# EAGLE design smokey powell board V1.4 (EAGLE 9.3.0)
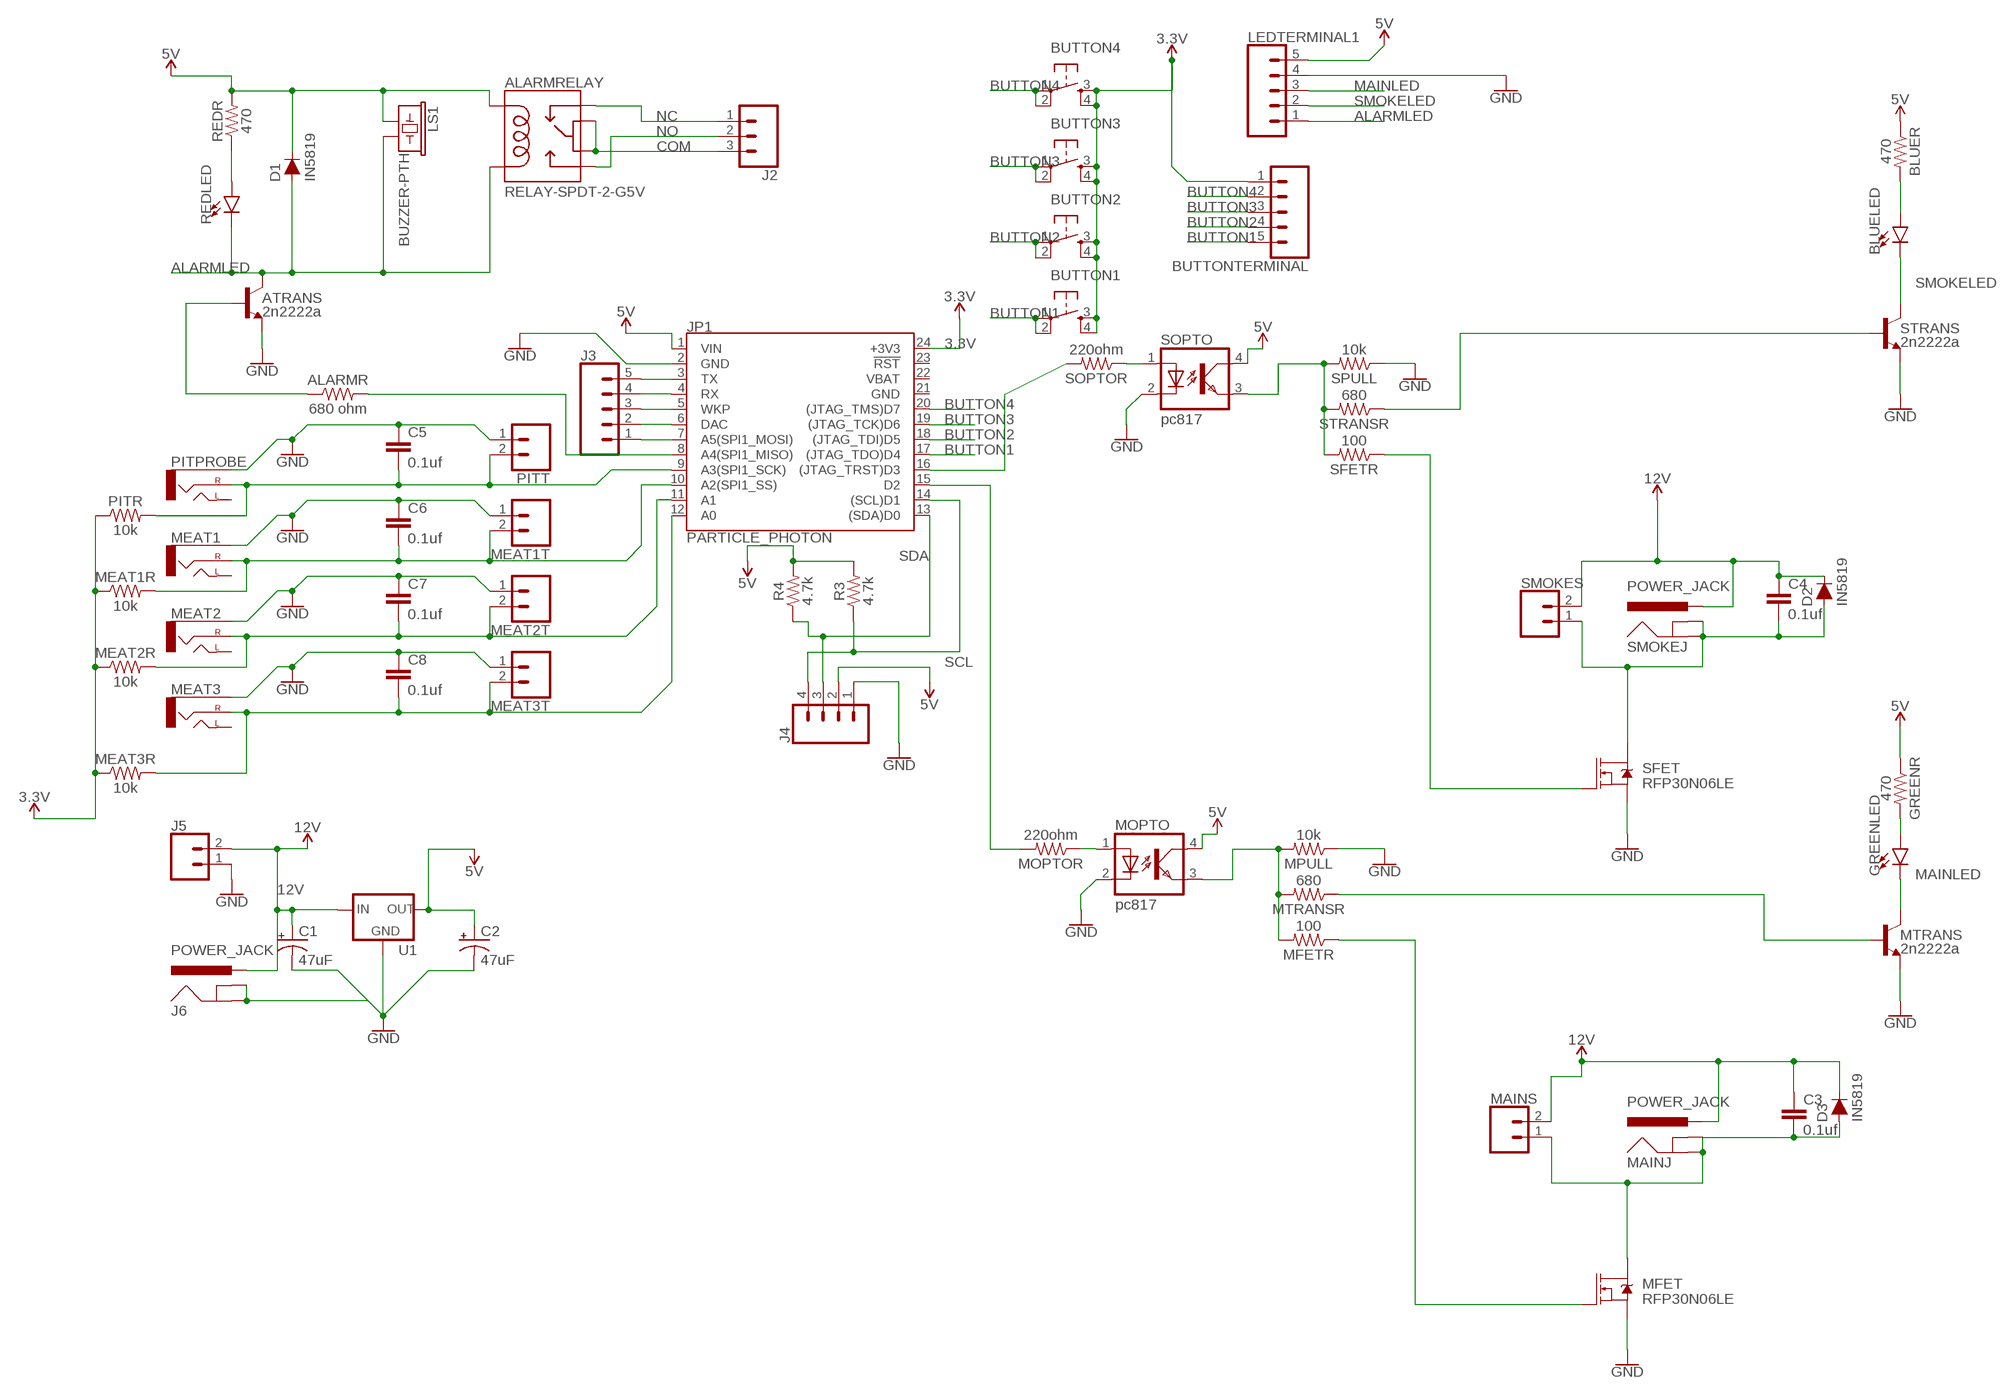
[diagram p0: schematic, sheet 1]

## Parts
ALARMR  680 ohm  RESISTORAXIAL-0.3  [AXIAL-0.3]
ALARMRELAY  RELAY-SPDT-2-G5V  [RELAY-G5V]
ATRANS  2n2222a  TRANS_NPN-P2N2222A  [TO-92]
BLUELED  LED5MM  [LED_5MM]
BLUER  470  RESISTORAXIAL-0.3  [AXIAL-0.3]
BUTTON1  TAC_SWITCHPTH  [TACTILE-PTH]
BUTTON2  TAC_SWITCHPTH  [TACTILE-PTH]
BUTTON3  TAC_SWITCHPTH  [TACTILE-PTH]
BUTTON4  TAC_SWITCHPTH  [TACTILE-PTH]
BUTTONTERMINAL  CONN_05PTH_LONGPADS  [1X05_LONGPADS]
C1  47uF  100UF-POLAR-RADIAL-2.5MM-25V-20%  [CPOL-RADIAL-2.5MM-6.5MM]
C2  47uF  100UF-POLAR-RADIAL-2.5MM-25V-20%  [CPOL-RADIAL-2.5MM-6.5MM]
C3  0.1uf  C2.5/2  [C2.5-2]
C4  0.1uf  C2.5/2  [C2.5-2]
C5  0.1uf  C2.5/2  [C2.5-2]
C6  0.1uf  C2.5/2  [C2.5-2]
C7  0.1uf  C2.5/2  [C2.5-2]
C8  0.1uf  C2.5/2  [C2.5-2]
D1  IN5819  DIODE-PTH  [DIODE-1N4001]
D2  IN5819  DIODE-PTH  [DIODE-1N4001]
D3  IN5819  DIODE-PTH  [DIODE-1N4001]
GREENLED  LED5MM  [LED_5MM]
GREENR  470  RESISTORAXIAL-0.3  [AXIAL-0.3]
J2  CONN_03-SCREW-5MM  [SCREWTERMINAL-5MM-3]
J3  CONN_05  [1X05]
J4  CONN_04LONGPADS  [1X04_LONGPADS]
J5  CONN_025MM  [SCREWTERMINAL-5MM-2]
J6  POWER_JACK  [POWER_JACK_PTH]
JP1  PARTICLE_PHOTON  [PARTICLE_PHOTON]
LEDTERMINAL1  CONN_05PTH_LONGPADS  [1X05_LONGPADS]
LS1  BUZZER-PTH  [BUZZER-12MM]
MAINJ  POWER_JACK  [POWER_JACK_PTH]
MAINS  CONN_025MM  [SCREWTERMINAL-5MM-2]
MEAT1  AUDIO_JACK_2.5MM_2.5MM  [STEREOJACK2.5MM_STEREOJACK2.5MM]
MEAT1R  10k  1MOHM-HORIZ-1/4W-5%  [AXIAL-0.3]
MEAT1T  CONN_02PTH3  [1X02_LONGPADS]
MEAT2  AUDIO_JACK_2.5MM_2.5MM  [STEREOJACK2.5MM_STEREOJACK2.5MM]
MEAT2R  10k  1MOHM-HORIZ-1/4W-5%  [AXIAL-0.3]
MEAT2T  CONN_02PTH3  [1X02_LONGPADS]
MEAT3  AUDIO_JACK_2.5MM_2.5MM  [STEREOJACK2.5MM_STEREOJACK2.5MM]
MEAT3R  10k  1MOHM-HORIZ-1/4W-5%  [AXIAL-0.3]
MEAT3T  CONN_02PTH3  [1X02_LONGPADS]
MFET  RFP30N06LE  MOSFET-NCH-FQP30N06L  [TO220V]
MFETR  100  RESISTORAXIAL-0.3  [AXIAL-0.3]
MOPTO  pc817  SFH618A-2  [DIP4]
MOPTOR  220ohm  RESISTORAXIAL-0.3  [AXIAL-0.3]
MPULL  10k  RESISTORAXIAL-0.3  [AXIAL-0.3]
MTRANS  2n2222a  TRANS_NPN-P2N2222A  [TO-92]
MTRANSR  680  RESISTORAXIAL-0.3  [AXIAL-0.3]
PITPROBE  AUDIO_JACK_2.5MM_2.5MM  [STEREOJACK2.5MM_STEREOJACK2.5MM]
PITR  10k  1MOHM-HORIZ-1/4W-5%  [AXIAL-0.3]
PITT  CONN_02PTH3  [1X02_LONGPADS]
R3  4.7k  RESISTORAXIAL-0.3  [AXIAL-0.3]
R4  4.7k  RESISTORAXIAL-0.3  [AXIAL-0.3]
REDLED  LED5MM  [LED_5MM]
REDR  470  RESISTORAXIAL-0.3  [AXIAL-0.3]
SFET  RFP30N06LE  MOSFET-NCH-FQP30N06L  [TO220V]
SFETR  100  RESISTORAXIAL-0.3  [AXIAL-0.3]
SMOKEJ  POWER_JACK  [POWER_JACK_PTH]
SMOKES  CONN_025MM  [SCREWTERMINAL-5MM-2]
SOPTO  pc817  SFH618A-2  [DIP4]
SOPTOR  220ohm  RESISTORAXIAL-0.3  [AXIAL-0.3]
SPULL  10k  RESISTORAXIAL-0.3  [AXIAL-0.3]
STRANS  2n2222a  TRANS_NPN-P2N2222A  [TO-92]
STRANSR  680  RESISTORAXIAL-0.3  [AXIAL-0.3]
U1  V_REG_78XXSINK  [TO220-IGO]

## Nets
3.3V: BUTTON1.3 BUTTON1.4 BUTTON2.3 BUTTON2.4 BUTTON3.3 BUTTON3.4 BUTTON4.3 BUTTON4.4 BUTTONTERMINAL.1 JP1.24(+3V3) MEAT1R.P$1 MEAT2R.P$1 MEAT3R.P$1 PITR.P$1
5V: ALARMRELAY.2 BLUER.P$1 C2.1(+) D1.C GREENR.P$1 J4.2 JP1.1(VIN) LEDTERMINAL1.5 LS1.+ MOPTO.4(COL) R3.P$2 R4.P$2 REDR.P$2 SOPTO.4(COL) U1.OUT
12V: C1.1(+) C3.1 C4.1 D2.C D3.C J5.2 J6.PWR MAINJ.PWR MAINS.2 SMOKEJ.PWR SMOKES.2 U1.IN
ALARMLED: ALARMRELAY.9 ATRANS.1(C) D1.A LEDTERMINAL1.1 LS1.- REDLED.K(C)
BUTTON1: BUTTON1.1 BUTTON1.2 BUTTONTERMINAL.5 JP1.17((JTAG_TDO)D4)
BUTTON2: BUTTON2.1 BUTTON2.2 BUTTONTERMINAL.4 JP1.18((JTAG_TDI)D5)
BUTTON3: BUTTON3.1 BUTTON3.2 BUTTONTERMINAL.3 JP1.19((JTAG_TCK)D6)
BUTTON4: BUTTON4.1 BUTTON4.2 BUTTONTERMINAL.2 JP1.20((JTAG_TMS)D7)
COM: ALARMRELAY.5 ALARMRELAY.6 J2.3
GND: ATRANS.3(E) C1.2(-) C2.2(-) C5.1 C6.1 C7.1 C8.1 J4.1 J5.1 J6.GND J6.GNDBREAK JP1.2(GND) LEDTERMINAL1.4 MEAT1.RING1(SLEEVE) MEAT1T.1 MEAT2.RING1(SLEEVE) MEAT2T.1 MEAT3.RING1(SLEEVE) MEAT3T.1 MFET.3(S) MOPTO.2(C) MPULL.P$1 MTRANS.3(E) PITPROBE.RING1(SLEEVE) PITT.1 SFET.3(S) SOPTO.2(C) SPULL.P$1 STRANS.3(E) U1.GND
MAINLED: GREENLED.K(C) LEDTERMINAL1.3 MTRANS.1(C)
N$1: C7.2 JP1.11(A1) MEAT2.TIP(RIGHT) MEAT2R.P$2 MEAT2T.2
N$5: ALARMR.P$2 JP1.8(A4(SPI1_MISO))
N$6: MTRANS.2(B) MTRANSR.P$1
N$7: ALARMR.P$1 ATRANS.2(B)
N$8: STRANS.2(B) STRANSR.P$1
N$9: J3.5 JP1.3(TX)
N$10: J3.4 JP1.4(RX)
N$11: J3.3 JP1.5(WKP)
N$12: J3.2 JP1.6(DAC)
N$13: J3.1 JP1.7(A5(SPI1_MOSI))
N$14: MFET.1(G) MFETR.P$1
N$15: C3.2 D3.A MAINJ.GND MAINJ.GNDBREAK MAINS.1 MFET.2(D)
N$16: JP1.16((JTAG_TRST)D3) SOPTOR.P$2
N$17: JP1.15(D2) MOPTOR.P$2
N$18: SOPTO.1(A) SOPTOR.P$1
N$19: MOPTO.1(A) MOPTOR.P$1
N$20: MFETR.P$2 MOPTO.3(EMIT) MPULL.P$2 MTRANSR.P$2
N$21: SFETR.P$2 SOPTO.3(EMIT) SPULL.P$2 STRANSR.P$2
N$22: SFET.1(G) SFETR.P$1
N$23: REDLED.A REDR.P$1
N$24: C4.2 D2.A SFET.2(D) SMOKEJ.GND SMOKEJ.GNDBREAK SMOKES.1
N$25: BLUELED.A BLUER.P$2
N$27: GREENLED.A GREENR.P$2
N$28: C8.2 JP1.12(A0) MEAT3.TIP(RIGHT) MEAT3R.P$2 MEAT3T.2
N$29: C6.2 JP1.10(A2(SPI1_SS)) MEAT1.TIP(RIGHT) MEAT1R.P$2 MEAT1T.2
N$30: C5.2 JP1.9(A3(SPI1_SCK)) PITPROBE.TIP(RIGHT) PITR.P$2 PITT.2
NC: ALARMRELAY.1 J2.1
NO: ALARMRELAY.10 J2.2
SCL: J4.4 JP1.14((SCL)D1) R3.P$1
SDA: J4.3 JP1.13((SDA)D0) R4.P$1
SMOKELED: BLUELED.K(C) LEDTERMINAL1.2 STRANS.1(C)
Unconnected: JP1.23(!RST!) MEAT1.SHIELD(LEFT) MEAT2.SHIELD(LEFT) MEAT3.SHIELD(LEFT) PITPROBE.SHIELD(LEFT)

## Power pins joined to a net without a drawn wire
GND: JP1.21(GND)
VBAT: JP1.22(VBAT)

## Library data of the parts
ALARMR BLUER GREENR MFETR MOPTOR MPULL MTRANSR R3 R4 REDR SFETR SOPTOR SPULL STRANSR = SparkFun-Resistors:RESISTOR: Generic Resistor Package
ALARMRELAY = SparkFun-Retired:RELAY-SPDT-2: SPDT Relay w/ Two Common Terminals SPDT relay (COM-00100); SF_SKU: COM-00524
ATRANS MTRANS STRANS = SparkFun-DiscreteSemi:TRANS_NPN: NPN transistor Current controlled devices typically used to amplify current or used as a switch. BC547 - COM-08928 <http://www.sparkfun.com/products/8928> (TO-92 45V 100mA) (1.Collector 2.Base 3.Emitter) 2N3904 - COM-00521 <http://www.sparkfun.com/products/521> (TO-92 40V 200mA) (1.Emitter 2.Base 3.Collector) P2N2222A - COM-12852 <http://www.sparkfun.com/products/12852> (TO-92 40V 600mA) (1.Collector 2.Base 3.Emitter); PROD_ID: TRANS-09536; VALUE: 600mA/40V
BLUELED GREENLED REDLED = SparkFun-LED:LED: LED (Generic) Standard schematic elements and footprints for 5mm, 3mm, 1206, and 0603 sized LEDs. Generic LEDs with no color specified.
BUTTON1-BUTTON4 = SparkFun-Retired:TAC_SWITCH: Momentary Switch Button commonly used for reset or general input. Spark Fun Electronics SKU : COM-00097 SMT- SWCH-08247
BUTTONTERMINAL J3 LEDTERMINAL1 = SparkFun-Connectors:CONN_05: Multi connection point. Often used as Generic Header-pin footprint for 0.1 inch spaced/style header connections On any of the 0.1 inch spaced packages, you can populate with these: Break Away Headers - Straight <https://www.sparkfun.com/products/116> (PRT-00116) Break Away Male Headers - Right Angle <https://www.sparkfun.com/products/553> (PRT-00553) Female Headers <https://www.sparkfun.com/products/115> (PRT-00115) Break Away Headers - Machine Pin <https://www.sparkfun.com/products/117> (PRT-00117) Break Away Female Headers - Swiss Machine Pin <https://www.sparkfun.com/products/743> (PRT-00743) For SCREWTERMINALS and SPRING TERMINALS visit here: Screw Terimnals on SparkFun.com <https://www.sparkfun.com/search/results?term=Screw+Terminals> (5mm/3.5mm/2.54mm spacing) This device is also useful as a general connection point to wire up your design to another part of your project. Our various solder wires solder well into these plated through hole pads. Hook-Up Wire - Assortment (Stranded, 22 AWG) <https://www.sparkfun.com/products/11375> (PRT-11375) Hook-Up Wire - Assortment (Solid Core, 22 AWG) <https://www.sparkfun.com/products/11367> (PRT-11367) View the entire wire category on our website here <https://www.sparkfun.com/categories/141> Special notes: Molex polarized connector foot print use with SKU : PRT-08231 with associated crimp pins and housings. 1MM SMD Version SKU: PRT-10208
C1 C2 = SparkFun-Capacitors:100UF-POLAR: 100µF polarized capacitors A capacitor is a passive two-terminal electrical component used to store electrical energy temporarily in an electric field.; PROD_ID: CAP-08439; VALUE: 100uF
C3-C8 = capacitor-wima:C: CAPACITOR naming: grid - package width
D1-D3 = SparkFun-DiscreteSemi:DIODE: Diode These are standard reverse protection diodes and small signal diodes. SparkFun Products: SparkFun SparkPunk Sound Kit <https://www.sparkfun.com/products/11177> SparkFun ESP8266 Thing <https://www.sparkfun.com/products/13231>; PROD_ID: DIO-09176; VALUE: 1A/50V/1.1V
J2 = SparkFun-Connectors:CONN_03: Multi connection point. Often used as Generic Header-pin footprint for 0.1 inch spaced/style header connections On any of the 0.1 inch spaced packages, you can populate with these: Break Away Headers - Straight <https://www.sparkfun.com/products/116> (PRT-00116) Break Away Male Headers - Right Angle <https://www.sparkfun.com/products/553> (PRT-00553) Female Headers <https://www.sparkfun.com/products/115> (PRT-00115) Break Away Headers - Machine Pin <https://www.sparkfun.com/products/117> (PRT-00117) Break Away Female Headers - Swiss Machine Pin <https://www.sparkfun.com/products/743> (PRT-00743) Stackable Header - 3 Pin (Female, 0.1") <https://www.sparkfun.com/products/13875> (PRT-13875) For SCREWTERMINALS and SPRING TERMINALS visit here: Screw Terimnals on SparkFun.com <https://www.sparkfun.com/search/results?term=Screw+Terminals> (5mm/3.5mm/2.54mm spacing) This device is also useful as a general connection point to wire up your design to another part of your project. Our various solder wires solder well into these plated through hole pads. Hook-Up Wire - Assortment (Stranded, 22 AWG) <https://www.sparkfun.com/products/11375> (PRT-11375) Hook-Up Wire - Assortment (Solid Core, 22 AWG) <https://www.sparkfun.com/products/11367> (PRT-11367) View the entire wire category on our website here <https://www.sparkfun.com/categories/141> Special notes: Molex polarized connector foot print use with SKU : PRT-08232 with associated crimp pins and housings.; PROD_ID: CONN-10134; SF_SKU: PRT-08433
J4 = SparkFun-Connectors:CONN_04: Multi connection point. Often used as Generic Header-pin footprint for 0.1 inch spaced/style header connections On any of the 0.1 inch spaced packages, you can populate with these: Break Away Headers - Straight <https://www.sparkfun.com/products/116> (PRT-00116) Break Away Male Headers - Right Angle <https://www.sparkfun.com/products/553> (PRT-00553) Female Headers <https://www.sparkfun.com/products/115> (PRT-00115) Break Away Headers - Machine Pin <https://www.sparkfun.com/products/117> (PRT-00117) Break Away Female Headers - Swiss Machine Pin <https://www.sparkfun.com/products/743> (PRT-00743) For SCREWTERMINALS and SPRING TERMINALS visit here: Screw Terimnals on SparkFun.com <https://www.sparkfun.com/search/results?term=Screw+Terminals> (5mm/3.5mm/2.54mm spacing) This device is also useful as a general connection point to wire up your design to another part of your project. Our various solder wires solder well into these plated through hole pads. Hook-Up Wire - Assortment (Stranded, 22 AWG) <https://www.sparkfun.com/products/11375> (PRT-11375) Hook-Up Wire - Assortment (Solid Core, 22 AWG) <https://www.sparkfun.com/products/11367> (PRT-11367) View the entire wire category on our website here <https://www.sparkfun.com/categories/141> Special notes: Molex polarized connector foot print use with SKU : PRT-08231 with associated crimp pins and housings. 1MM SMD Version SKU: PRT-10208; PROD_ID: CONN-09696
J5 MAINS SMOKES = SparkFun-Connectors:CONN_02: Multi connection point. Often used as Generic Header-pin footprint for 0.1 inch spaced/style header connections On any of the 0.1 inch spaced packages, you can populate with these: Break Away Headers - Straight <https://www.sparkfun.com/products/116> (PRT-00116) Break Away Male Headers - Right Angle <https://www.sparkfun.com/products/553> (PRT-00553) Female Headers <https://www.sparkfun.com/products/115> (PRT-00115) Break Away Headers - Machine Pin <https://www.sparkfun.com/products/117> (PRT-00117) Break Away Female Headers - Swiss Machine Pin <https://www.sparkfun.com/products/743> (PRT-00743) For SCREWTERMINALS and SPRING TERMINALS visit here: Screw Terimnals on SparkFun.com <https://www.sparkfun.com/search/results?term=Screw+Terminals> (5mm/3.5mm/2.54mm spacing) This device is also useful as a general connection point to wire up your design to another part of your project. Our various solder wires solder well into these plated through hole pads. Hook-Up Wire - Assortment (Stranded, 22 AWG) <https://www.sparkfun.com/products/11375> (PRT-11375) Hook-Up Wire - Assortment (Solid Core, 22 AWG) <https://www.sparkfun.com/products/11367> (PRT-11367) View the entire wire category on our website here <https://www.sparkfun.com/categories/141> Special notes: Molex polarized connector foot print use with: PRT-08233 with associated crimp pins and housings. 2.54_SCREWTERM for use with PRT-10571. 3.5mm Screw Terminal footprints for PRT-08084 5mm Screw Terminal footprints for use with PRT-08432; SF_SKU: PRT-08432
J6 MAINJ SMOKEJ = SparkFun-Connectors:POWER_JACK: Power Jack Connector This is the standard 5.5mm barrel jack for power. The PTH is the most common, proven, reliable, footprint. The Slot footprint only works if the mill layer is transmitted to the PCB fab house so be warned. Here are the connectors we sell at SparkFun: DC Barrel Power Jack/Connector <https://www.sparkfun.com/products/119> (PRT-00119) DC Barrel Power Jack/Connector (SMD) <https://www.sparkfun.com/products/12748> (PRT-12748) DC Barrel Jack Adapter - Breadboard Compatible <https://www.sparkfun.com/products/10811> (PRT-10811) It is used on this SparkFun product (and many, many others): SparkFun RedBoard - Programmed with Arduino <https://www.sparkfun.com/products/12757> (DEV-12757) Also, if you need a mating power supply or connector, please check these out: Wall Adapter Power Supply - 9VDC 650mA <https://www.sparkfun.com/products/298> (TOL-00298) DC Barrel Jack Adapter - Male <https://www.sparkfun.com/products/10287> (PRT-10287); PROD_ID: CONN-08197
JP1 = SparkFun-Boards:PARTICLE_PHOTON: Particle Photon Footprint of the Particle Photon that is used as a basis for many Photon shields. SparkFun Products: Particle Photon <https://www.sparkfun.com/products/13764> SparkFun Photon ProtoShield <https://www.sparkfun.com/products/13598> SparkFun Photon micro OLED Shield <https://www.sparkfun.com/products/13628> SparkFun Photon IMU Shield <https://www.sparkfun.com/products/13629> SparkFun Photon Battery Shield <https://www.sparkfun.com/products/13626>
LS1 = SparkFun-Electromechanical:BUZZER: Buzzer Small round buzzers that operate around the audible 2kHz range. You can use these as speakers to create simple music or user interfaces. Variant Overview: PTH - Mini Speaker - PC Mount 12mm 2.048kHz <https://www.sparkfun.com/products/7950> PTH_KIT - Mini Speaker - PC Mount 12mm 2.048kHz <https://www.sparkfun.com/products/7950> KIT simplifies soldering by adding stop mask to one side of the pads. PTH_NO_SILK - Mini Speaker - PC Mount 12mm 2.048kHz <https://www.sparkfun.com/products/7950> No silkscreen indicator of buzzer outline. PTH_KIT_NO_SILK - Mini Speaker - PC Mount 12mm 2.048kHz <https://www.sparkfun.com/products/7950> KIT package w/o silkscreen SMD - Buzzer Audio Magnetic (CCV-084B16) SMD buzzer used on, e.g. the LilyPad Buzzer <https://www.sparkfun.com/products/8463> and RFID USB Reader <https://www.sparkfun.com/products/9963>. SMD_KIT - Buzzer Audio Magnetic (CCV-084B16) SMD Buzzer with elongated pins to make soldering easier. Used on the SparkFun Simon Says - Surface Mount Soldering Kit <https://www.sparkfun.com/products/10935>.; PROD_ID: COMP-08253; SF_SKU: COM-07950
MEAT1-MEAT3 PITPROBE = SparkFun-Connectors:AUDIO_JACK_2.5MM: Audio Jack 2.5mm variants of PTH and SMT audio jacks. SparkFun Products: SparkFun PicoBoard <https://www.sparkfun.com/products/11888>- 2.5mm SMD; PROD_ID: CONN-09878
MEAT1R MEAT2R MEAT3R PITR = SparkFun-Resistors:1MOHM: 1MΩ resistor A resistor is a passive two-terminal electrical component that implements electrical resistance as a circuit element. Resistors act to reduce current flow, and, at the same time, act to lower voltage levels within circuits. - Wikipedia; PROD_ID: RES-09329; VALUE: 1M
MEAT1T MEAT2T MEAT3T PITT = SparkFun-Connectors:CONN_02: Multi connection point. Often used as Generic Header-pin footprint for 0.1 inch spaced/style header connections On any of the 0.1 inch spaced packages, you can populate with these: Break Away Headers - Straight <https://www.sparkfun.com/products/116> (PRT-00116) Break Away Male Headers - Right Angle <https://www.sparkfun.com/products/553> (PRT-00553) Female Headers <https://www.sparkfun.com/products/115> (PRT-00115) Break Away Headers - Machine Pin <https://www.sparkfun.com/products/117> (PRT-00117) Break Away Female Headers - Swiss Machine Pin <https://www.sparkfun.com/products/743> (PRT-00743) For SCREWTERMINALS and SPRING TERMINALS visit here: Screw Terimnals on SparkFun.com <https://www.sparkfun.com/search/results?term=Screw+Terminals> (5mm/3.5mm/2.54mm spacing) This device is also useful as a general connection point to wire up your design to another part of your project. Our various solder wires solder well into these plated through hole pads. Hook-Up Wire - Assortment (Stranded, 22 AWG) <https://www.sparkfun.com/products/11375> (PRT-11375) Hook-Up Wire - Assortment (Solid Core, 22 AWG) <https://www.sparkfun.com/products/11367> (PRT-11367) View the entire wire category on our website here <https://www.sparkfun.com/categories/141> Special notes: Molex polarized connector foot print use with: PRT-08233 with associated crimp pins and housings. 2.54_SCREWTERM for use with PRT-10571. 3.5mm Screw Terminal footprints for PRT-08084 5mm Screw Terminal footprints for use with PRT-08432
MFET SFET = SparkFun-DiscreteSemi:MOSFET-NCH: N-channel MOSFETs Voltage controlled devices that allow control of high current outputs. SparkFun Products: SparkFun OpenScale <https://www.sparkfun.com/products/13261> SparkFun Digital Sandbox <https://www.sparkfun.com/products/12651> SparkFun Monster Moto Shield <https://www.sparkfun.com/products/10182> SparkFun MOSFET Power Controller <https://www.sparkfun.com/products/11214>; PROD_ID: TRANS-10060; VALUE: 60V/32A/35mΩ
MOPTO SOPTO = optocoupler:SFH618?*: Optocoupler, Phototransistor Output, Low Input Current Source: Data sheet <http://www.vishay.com/docs/83673/sfh618.pdf>; MF: VISHAY/TELEFUNKEN; MPN: SFH618A-2; OC_FARNELL: 6424855; OC_NEWARK: 21H7744
U1 = SparkFun-IC-Power:V_REG_78XX: Voltage Regulator Standard 78xx regulator. IGO (Input Ground Output). Spark Fun Electronics SKU : COM-00107

## Board
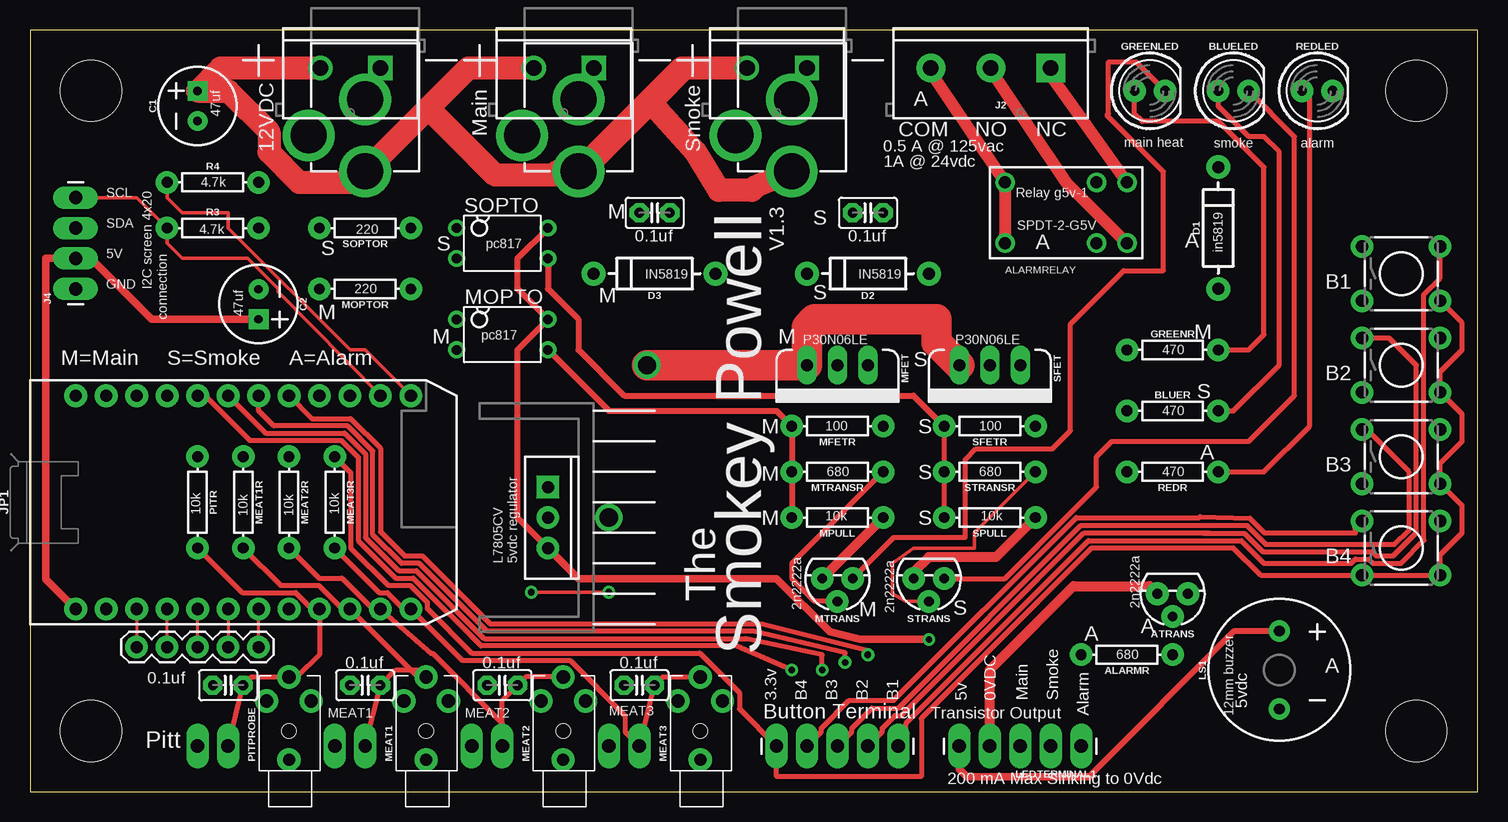
[diagram p1: board, top side]
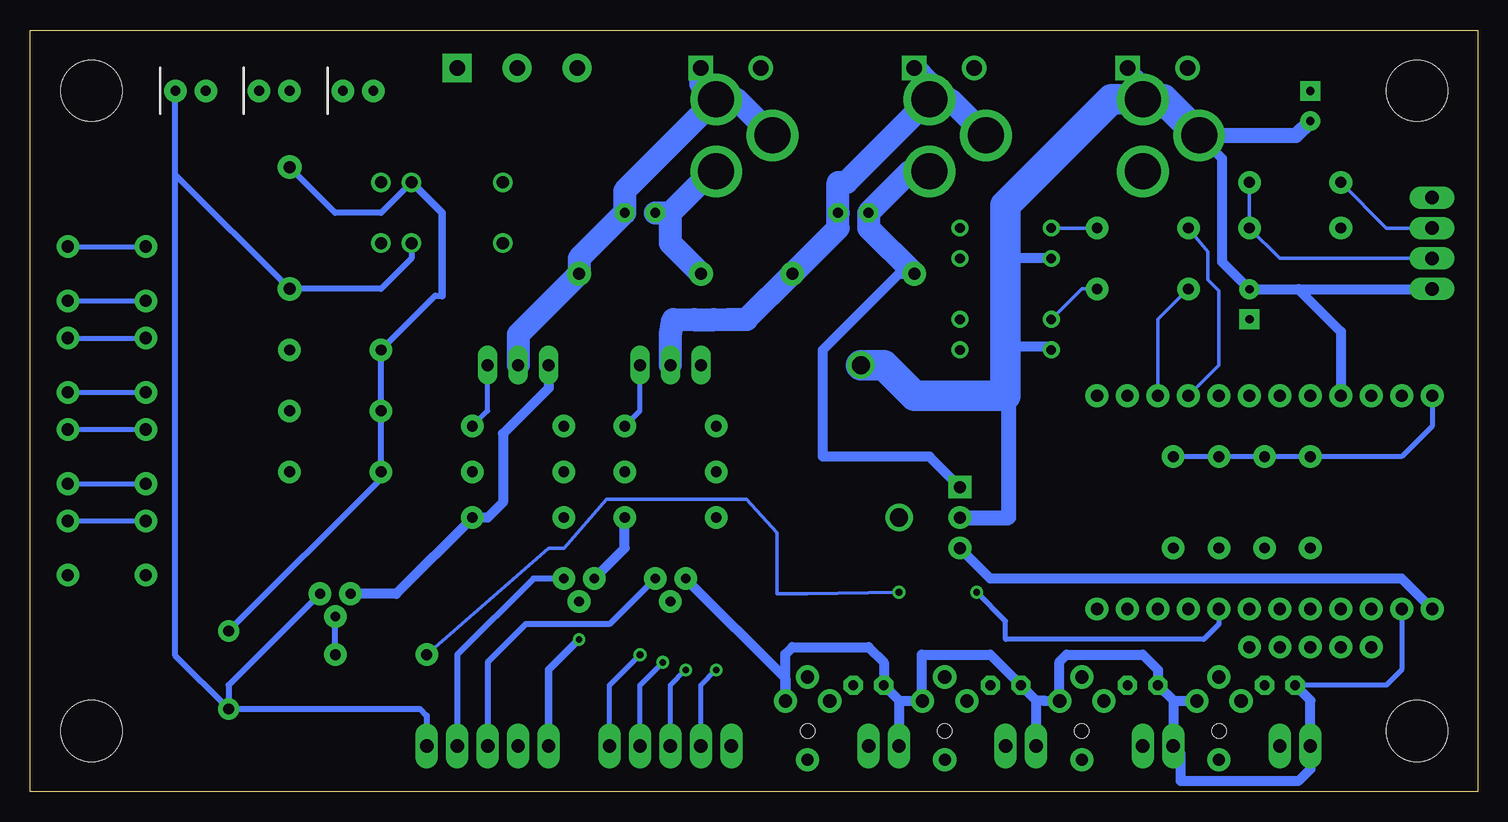
[diagram p2: board, bottom side, seen from below]

Size 120.7 x 63.49 mm. Coordinates in mm from the lower left corner, seen from the top.
Outline: 0,0 120.7,0 120.7,63.49 0,63.49 0,0
Copper layers (1*16): Top 0.035mm / dielectric 1.5mm / Bottom 0.035mm
Design rules "SparkFun": minimum track width 8mil, minimum drill 20mil, track to track 8mil, track to pad 8mil, pad to pad 8mil, via to via 8mil, smd to smd 8mil, copper to edge 8mil, drill to drill 8mil, minimum pad ring 12mil, minimum via ring 10mil, stop-mask expansion 4mil, vias tented up to drill 20mil, thermal gap 10mil
Holes 5.08 mm at 5.08,58.42 5.08,5.08 115.57,5.08 115.57,58.42

### Footprints (pad centres in the part's own frame; a part is rotated, then mirrored left to right if it is on the bottom)
AXIAL-0.3 = drill 0.9 pad 1.88: P$1 -3.81,0; P$2 3.81,0
RELAY-G5V = drill 1.016: 1 5.08,2.54; 2 2.54,2.54; 5 -5.08,2.54; 6 -5.08,-2.54; 9 2.54,-2.54; 10 5.08,-2.54
TO-92 = drill 0.813 pad 1.88: 1 -1.27,0; 2 0,1.905; 3 1.27,0
LED_5MM = drill 0.813 pad 1.88: A -1.27,0; K 1.27,0
TACTILE-PTH = drill 1.016 pad 1.88: 1 -3.251,2.261; 2 3.251,2.261; 3 -3.251,-2.261; 4 3.251,-2.261
1X05_LONGPADS = drill 1.118 pad 1.88 long: 1 0,0; 2 2.54,0; 3 5.08,0; 4 7.62,0; 5 10.16,0
CPOL-RADIAL-2.5MM-6.5MM = drill 0.7 pad 1.651 square: 1 1.25,0 | drill 0.7 pad 1.651: 2 -1.25,0
C2.5-2 = drill 0.813 pad 1.6 octagon: 1 -1.27,0; 2 1.27,0
DIODE-1N4001 = drill 1 pad 1.981: A -5.08,0; C 5.08,0
SCREWTERMINAL-5MM-3 = drill 1.3 pad 2.413 square: 1 0,0 | drill 1.3 pad 2.413: 2 5,0; 3 10,0
1X05 = drill 1.016 pad 1.88: 1 0,0; 2 2.54,0; 3 5.08,0; 4 7.62,0; 5 10.16,0
1X04_LONGPADS = drill 1.118 pad 1.88 long: 1 0,0; 2 2.54,0; 3 5.08,0; 4 7.62,0
SCREWTERMINAL-5MM-2 = drill 1.3 pad 2.032 square: 1 0,0 | drill 1.3 pad 2.032: 2 5,0
POWER_JACK_PTH = drill 2.997 pad 4.318: GND 0,7.7; GNDBREAK 4.7,10.7; PWR 0,13.7
PARTICLE_PHOTON = drill 1.016 pad 1.905: 1 -8.89,13.97; 2 -8.89,11.43; 3 -8.89,8.89; 4 -8.89,6.35; 5 -8.89,3.81; 6 -8.89,1.27; 7 -8.89,-1.27; 8 -8.89,-3.81; 9 -8.89,-6.35; 10 -8.89,-8.89; 11 -8.89,-11.43; 12 -8.89,-13.97; 13 8.89,-13.97; 14 8.89,-11.43; 15 8.89,-8.89; 16 8.89,-6.35; 17 8.89,-3.81; 18 8.89,-1.27; 19 8.89,1.27; 20 8.89,3.81; 21 8.89,6.35; 22 8.89,8.89; 23 8.89,11.43; 24 8.89,13.97
BUZZER-12MM = drill 0.9 pad 1.778: + 3.25,0; - -3.25,0
STEREOJACK2.5MM_STEREOJACK2.5MM = drill 1.1 pad 1.93: RING1 2.5,-1.85; RING2 2.5,1.85; TIP 4.5,0 | drill 1 pad 1.93: SHIELD -2.4,0 | hole 1.2: 0,0
1X02_LONGPADS = drill 1.118 pad 1.88 long: 1 0,0; 2 2.54,0
TO220V = drill 1.016 long: 1 -2.54,0; 2 0,0; 3 2.54,0
DIP4 = drill 0.8: 1 -1.27,-3.81; 2 1.27,-3.81; 3 1.27,3.81; 4 -1.27,3.81
TO220-IGO = drill 1 pad 1.88: GND 0,0; OUT 2.54,0 | drill 1 pad 1.88 square: IN -2.54,0

### Placement (x,y rotation side)
ALARMR  91.44,11.43 180 top
ALARMRELAY  86.36,48.26 0 top
ATRANS  95.25,16.51 180 top
BLUELED  100.33,58.42 0 top
BLUER  95.25,31.75 0 top
BUTTON1  114.3,43.18 0 top
BUTTON2  114.3,35.56 0 top
BUTTON3  114.3,27.94 0 top
BUTTON4  114.3,20.32 0 top
BUTTONTERMINAL  62.23,3.81 0 top
C1  13.97,57.15 90 top
C2  19.05,40.64 270 top
C3  52.07,48.26 0 top
C4  69.85,48.26 0 top
C5  16.51,8.89 0 top
C6  27.94,8.89 0 top
C7  39.37,8.89 0 top
C8  50.8,8.89 0 top
D1  99.06,46.99 90 top
D2  69.85,43.18 180 top
D3  52.07,43.18 180 top
GREENLED  93.34,58.42 0 top
GREENR  95.25,36.83 0 top
J2  85.09,60.33 180 top
J3  19.05,12.06 180 top
J4  3.81,41.91 90 top
J5  29.21,60.33 180 top
J6  27.94,65.41 180 top
JP1  17.78,24.13 90 top
LEDTERMINAL1  87.63,3.81 180 top
LS1  104.14,10.16 90 top
MAINJ  45.72,65.41 180 top
MAINS  46.99,60.33 180 top
MEAT1  33.02,5.08 90 top
MEAT1R  17.78,24.13 270 top
MEAT1T  25.4,3.81 0 top
MEAT2  44.45,5.08 90 top
MEAT2R  21.59,24.13 270 top
MEAT2T  36.83,3.81 0 top
MEAT3  55.88,5.08 90 top
MEAT3R  25.4,24.13 270 top
MEAT3T  48.26,3.81 0 top
MFET  67.31,35.56 180 top
MFETR  67.31,30.48 180 top
MOPTO  39.37,38.1 270 top
MOPTOR  27.94,41.91 180 top
MPULL  67.31,22.86 180 top
MTRANS  67.31,17.78 180 top
MTRANSR  67.31,26.67 180 top
PITPROBE  21.59,5.08 90 top
PITR  13.97,24.13 270 top
PITT  13.97,3.81 0 top
R3  15.24,46.99 0 top
R4  15.24,50.8 0 top
REDLED  107.31,58.42 0 top
REDR  95.25,26.67 180 top
SFET  80.01,35.56 180 top
SFETR  80.01,30.48 180 top
SMOKEJ  63.5,65.41 180 top
SMOKES  64.77,60.33 180 top
SOPTO  39.37,45.72 270 top
SOPTOR  27.94,46.99 180 top
SPULL  80.01,22.86 180 top
STRANS  74.93,17.78 180 top
STRANSR  80.01,26.67 180 top
U1  43.18,22.86 270 top

### Tracks (layer width: path | path; a pad name or v marks a point on that pad's centre or on a via)
3.3V
  Top 0.406: MEAT3R.P$1 26.75,26.59 26.75,20.32 29.86,17.21 31.7,17.21 33.11,15.8 33.11,15.28 36.83,11.56 55.84,11.56 59.13,8.27 59.13,6.91 BUTTONTERMINAL.1 62.23,1.27 74.3,1.27 74.3,6.12 88.49,20.32 100.33,20.32 102.59,18.06 BUTTON4.3 BUTTON4.4 117.55,19.76 119.38,21.59 119.38,23.85 BUTTON3.4 117.55,27.38 119.38,29.21 119.38,31.47 BUTTON2.4 117.55,35 119.38,36.83 119.38,39.09 BUTTON1.4
  Bottom 0.406: JP1.24 3.81,30.48 6.35,27.94 PITR.P$1 MEAT1R.P$1 MEAT2R.P$1 MEAT3R.P$1 | BUTTON1.4 BUTTON1.3 | BUTTON2.4 BUTTON2.3 | BUTTON3.4 BUTTON3.3
5V  (via drill 0.51)
  Top 0.305: 1.27,44.45 1.27,17.78 JP1.1
  Top 0.508: U1.OUT 40.64,22.86 40.64,36.83 MOPTO.4 40.64,41.91 40.64,44.45 SOPTO.4 | 88.27,1.27 100.41,13.41 LS1.+
  Top 0.61: C2.1 10.14,39.39 5.08,44.45 J4.2 1.32,44.45 1.32,17.73 JP1.1 | U1.OUT 45.72,17.78 62.23,17.78 66.67,13.34 69.2,12.7 v74.93,12.7 | 88.27,1.27 78.11,1.27 77.47,1.91 LEDTERMINAL1.5
  Bottom 0.305: J4.2 16.51,44.45 R3.P$2 R4.P$2
  Bottom 0.508: LS1.+ 91.44,26.11 REDR.P$2 BLUER.P$1 GREENR.P$1 86.92,41.35 86.36,41.35 | ALARMRELAY.2 91.44,48.26 95.25,48.26 D1.C
  Bottom 0.61: ALARMRELAY.2 86.36,48.26 86.36,41.35 | v74.93,12.7 77.47,10.16 LEDTERMINAL1.5
  Bottom 0.813: JP1.1 6.35,17.78 40.64,17.78 U1.OUT
12V
  Top 1.016: 27.94,50.8 J6.PWR | MAINJ.PWR 46.62,51.7 52.07,57.15 55.24,60.33 SMOKES.2
  Top 1.905: J5.2 15.89,60.33 C1.1 16.53,58.4 19.93,55.01 19.93,53.33 22.46,50.8 27.94,50.8 | J6.PWR 33.2,56.97 | 33.2,56.97 36.56,60.33 MAINS.2 | 33.2,56.97 38.78,51.39 43.66,51.39 43.98,51.7 MAINJ.PWR 54.34,60.33 SMOKES.2 | SMOKEJ.PWR 60.49,50.44 60.17,50.12 57.43,50.12 55.48,53.33 51.67,57.55 52.07,57.15
  Bottom 0.813: U1.IN 45.72,27.94 54.61,27.94 54.61,36.83 48.26,43.18 D3.C | 66.94,48.26 SMOKEJ.PWR | 67.31,48.26 66.94,48.26 | D2.C 66.94,45.35 66.94,48.26
  Bottom 1.905: MAINJ.PWR 47.35,51.7 C3.1 50.8,46.99 D3.C | D2.C 67.31,45.72 67.31,48.26 | C4.1 67.31,48.26 | 67.31,48.26 63.87,51.7 SMOKEJ.PWR
ALARMLED
  Bottom 0.508: ALARMRELAY.9 88.9,44.45 91.44,41.91 D1.A 108.58,51.44 REDLED.K 108.58,11.36 LS1.- | ATRANS.1 104.14,8.89 LS1.- | LS1.- 88.19,6.91 87.63,6.35 LEDTERMINAL1.1
BUTTON1  (via drill 0.55)
  Top 0.406: JP1.17 23.5,31.11 26.71,31.11 29.21,28.62 29.21,21.67 31.23,19.66 32.7,19.66 38.36,14 60.98,14 61.01,13.97 69.85,11.75 v69.85,11.43 | BUTTON1.2 117.55,42.82 116.2,41.48 116.2,20.95 114.3,19.05 111.96,19.05 111.61,19.41 110.49,19.41 110.14,19.05 102.87,19.05 100.99,20.93 88.24,20.93 73.03,5.71 73.03,4.45 BUTTONTERMINAL.5
  Bottom 0.406: BUTTONTERMINAL.5 72.39,8.89 v69.85,11.43 | BUTTON1.2 BUTTON1.1
BUTTON2  (via drill 0.55)
  Top 0.406: JP1.18 19.05,31.77 20.32,30.5 26.46,30.5 28.57,28.39 28.57,21.45 30.97,19.05 32.45,19.05 38.11,13.39 60.32,13.39 67.94,11.58 v67.94,10.79 | BUTTONTERMINAL.4 71.04,5 71.04,5.31 72.09,6.35 72.62,6.35 87.86,21.59 97.79,21.59 | 97.79,21.59 98.31,21.59 | 97.79,21.59 97.84,21.54 101.24,21.54 102.77,20.02 111.86,20.02 112.22,19.66 113.64,19.66 115.57,21.59 115.57,35.56 113.31,37.82 BUTTON2.1
  Bottom 0.406: BUTTONTERMINAL.4 69.85,8.89 v67.94,10.79 | BUTTON2.2 BUTTON2.1
BUTTON3  (via drill 0.55)
  Top 0.406: JP1.19 19.63,29.9 26.21,29.9 27.96,28.14 27.96,21.2 30.73,18.43 32.21,18.43 37.86,12.78 59.61,12.78 59.71,12.74 66.03,11.41 66.04,11.4 v66.04,10.16 | BUTTONTERMINAL.3 68.5,5 68.5,5.31 70.18,6.99 72.39,6.99 87.61,22.2 101.44,22.2 103.02,20.62 113.74,20.62 114.96,21.84 114.96,26.67 111.43,30.2 BUTTON3.1
  Bottom 0.406: BUTTONTERMINAL.3 67.31,8.89 v66.04,10.16 | BUTTON3.2 BUTTON3.1
BUTTON4  (via drill 0.55)
  Top 0.406: JP1.20 14.59,33.02 18.32,29.29 25.96,29.29 27.36,27.89 27.36,20.94 30.48,17.82 31.96,17.82 37.6,12.17 58.95,12.17 v63.5,10.16 | BUTTONTERMINAL.2 65.96,5 65.96,5.31 68.28,7.62 71.98,7.62 87.22,22.86 97.47,22.86 97.52,22.94 101.7,22.81 102.92,21.59 110.49,21.59 110.49,22.02 BUTTON4.1
  Bottom 0.406: BUTTONTERMINAL.2 64.77,8.89 v63.5,10.16 | BUTTON4.2 BUTTON4.1
COM
  Top 1.016: J2.3 74.93,60.16 ALARMRELAY.5 ALARMRELAY.6
GND  (via drill 1.52)
  Top 0.813: LEDTERMINAL1.4 80.01,10.16 87,17.14 93.34,17.14 ATRANS.3 | SPULL.P$1 80.52,19.56 74.93,19.56 73.66,18.29 STRANS.3 | MPULL.P$1 MTRANS.3
  Top 2.54: v51.44,35.56 MFET.3 64.77,38.73 65.41,39.37 75.56,39.37 75.56,37.47 SFET.3
  Bottom 0.406: JP1.2 6.35,10.16 7.62,8.89 C5.1
  Bottom 0.813: SFET.3 77.47,33.66 81.28,29.84 81.28,24.13 82.55,22.86 SPULL.P$1 90.17,16.51 ATRANS.3 | STRANS.3 71.12,20.32 MPULL.P$1 | MTRANS.3 57.73,9.47 MEAT3.RING1 57.73,11.48 57.15,12.06 50.8,12.06 49.53,10.79 C8.1 | C8.1 48.22,7.58 MEAT2.RING1 46.35,7.63 46.35,11.43 40.64,11.43 C7.1 36.83,7.62 | C8.1 48.26,7.62 MEAT3T.1 48.26,3.17 | 36.83,7.62 36.18,7.62 36.14,7.58 MEAT1.RING1 34.87,10.85 34.29,11.43 27.94,11.43 26.67,10.16 C6.1 | 36.83,7.62 MEAT2T.1 | C6.1 25.36,7.58 PITPROBE.RING1 | C6.1 25.4,7.62 MEAT1T.1 24.77,3.17 24.77,0.89 14.99,0.89 13.97,1.91 PITT.1 13.97,7.62 C5.1 | J6.GNDBREAK 21.34,52.8 21.34,44.18 C2.2 | C2.2 3.83,41.89 J4.1 | C2.2 14.97,41.89 11.43,38.35 JP1.21 | SOPTO.2 39.37,44.45 | MOPTO.2 35.81,37.08 39.37,37.08
  Bottom 1.27: J6.GND 27.94,59.05 J5.1 | J6.GNDBREAK 15.16,54.7 C1.2 | U1.GND 39.12,22.86 39.12,32.77 39.37,33.02
  Bottom 2.54: J6.GNDBREAK 26.24,57.7 J6.GND 30.56,57.7 39.37,48.9 39.37,44.45 39.37,37.08 39.37,33.02 46.99,33.02 49.53,35.56 v51.44,35.56
MAINLED
  Top 0.406: MTRANS.1 72.01,21.21 77.98,21.21 77.98,27.69 78.87,28.57 85.22,28.57 86.74,30.1 86.74,38.99 91.19,43.43 94.49,43.43 94.49,51.69 89.79,56.39 89.92,56.52 89.92,60.83 92.2,60.83 GREENLED.K
  Bottom 0.508: MTRANS.1 72.39,13.97 79.38,13.97 82.55,10.79 LEDTERMINAL1.3
N$1
  Top 0.406: 39.37,5.73 33.57,11.54 33.42,11.54 JP1.11 28.59,15.24 26.01,17.82 24.09,17.82 MEAT2R.P$2 | MEAT2T.2 39.37,5.73 | 39.37,5.73 39.37,7.62 C7.2 41.33,9.58 MEAT2.TIP
N$5  (via drill 0.55)
  Top 0.305: v48.26,16.64 v41.78,16.64
  Bottom 0.305: ALARMR.P$2 77.47,20.32 76.2,20.32 72.64,24.38 60.96,24.38 58.42,21.59 58.42,16.51 55.88,16.51 v48.26,16.64
  Bottom 0.406: JP1.8 21.59,13.97 22.86,12.7 39.37,12.7 39.37,14.22 v41.78,16.64
N$6
  Top 0.406: MTRANS.2 65.41,15.88 63.5,17.78 63.5,19.05 MTRANSR.P$1
N$7
  Bottom 0.508: ALARMR.P$1 ATRANS.2
N$8
  Top 0.305: STRANS.2 73.03,15.88 71.88,16.51 71.88,19.05 73.66,20.32 78.74,20.32 78.74,21.59 STRANSR.P$1
N$9
  Top 0.254: JP1.3 J3.5
N$10
  Top 0.254: J3.4 JP1.4
N$11
  Top 0.254: J3.3 JP1.5
N$12
  Top 0.254: JP1.6 J3.2
N$13
  Top 0.254: J3.1 JP1.7
N$14
  Bottom 0.406: MFETR.P$1 69.85,31.75 MFET.1
N$15
  Bottom 1.905: MFET.2 67.31,38.1 67.1,39.37 65.33,39.36 63.7,39.36 62.44,39.37 60.96,39.37 D3.A 53.34,46.99 C3.2 53.34,50.8 52.62,50.8 MAINJ.GND | MAINJ.GND 45.72,59.05 MAINS.1 | MAINJ.GND 44.02,57.7 MAINJ.GNDBREAK
N$16
  Bottom 0.305: JP1.16 21.59,35.56 21.59,41.76 22.53,42.7 22.53,45.01 SOPTOR.P$2
N$17
  Bottom 0.305: JP1.15 26.67,39.37 MOPTOR.P$2
N$18
  Bottom 0.305: SOPTOR.P$1 SOPTO.1
N$19
  Bottom 0.305: MOPTOR.P$1 33.02,41.91 MOPTO.1
N$20
  Top 0.508: MOPTO.3 48.26,31.75 62.23,31.75 MFETR.P$2 MTRANSR.P$2 MPULL.P$2
N$21
  Top 0.406: SFETR.P$2 STRANSR.P$2 SPULL.P$2
  Top 0.508: SOPTO.3 43.18,41.91 45.72,39.37 45.72,36.83 49.53,33.02 73.66,33.02 SFETR.P$2
N$22
  Bottom 0.406: SFETR.P$1 82.55,31.75 SFET.1
N$23
  Top 0.406: REDR.P$1 102.87,26.67 106.68,30.48 106.68,57.78 REDLED.A
N$24
  Bottom 1.905: SMOKEJ.GNDBREAK 61.8,57.7 SMOKEJ.GND | SMOKEJ.GND 64.77,58.98 SMOKES.1 | SMOKEJ.GND 71.12,50.09 C4.2 74.93,44.45 D2.A 80.01,38.1 SFET.2
N$25
  Top 0.406: BLUER.P$2 100.33,31.75 104.14,35.56 104.14,53.34 102.87,54.61 101.6,54.61 99.06,57.15 BLUELED.A
N$26  (via drill 1.52)
  other vias: 48.26,22.86
N$27
  Top 0.406: GREENR.P$2 101.6,36.83 102.87,38.1 102.87,52.07 99.06,55.88 92.71,55.88 92.08,56.52 GREENLED.A
N$28
  Top 0.406: MEAT3R.P$2 29.12,16.6 29.77,16.6 31.13,15.24 JP1.12 36.04,10.95 45.02,10.95 49.61,6.36 49.61,5 MEAT3T.2 C8.2 52.76,9.58 MEAT3.TIP
N$29
  Top 0.406: MEAT1R.P$2 20.89,17.21 24.08,17.21 26.05,15.24 JP1.10 32.33,9.58 MEAT1.TIP 32.44,10.16 30.48,10.16 C6.2 MEAT1T.2
N$30
  Top 0.406: PITR.P$2 17.69,16.6 22.15,16.6 23.51,15.24 JP1.9 24.13,11.43 22.28,9.58 PITPROBE.TIP 18.47,9.58 C5.2 PITT.2
NC
  Top 1.016: J2.1 85.09,59.69 ALARMRELAY.1
NO
  Top 1.016: J2.2 80.01,60.24 86.36,50.8 ALARMRELAY.10
SCL
  Top 0.305: 20.69,41.98 20.69,41.91 | 20.69,41.91 20.69,41.67 JP1.14 | J4.4 8.89,49.53 R3.P$1 11.43,45.72 12.7,44.45 18.16,44.45 20.23,42.38 20.23,42.37 20.69,41.91
SDA
  Top 0.305: JP1.13 27.94,36.83 26.67,36.83 16.51,46.99 16.51,48.26 12.7,48.26 11.43,49.53 R4.P$1
  Bottom 0.305: J4.3 7.62,46.99 R4.P$1
SMOKELED
  Top 0.406: STRANS.1 81.28,17.78 88.9,25.4 88.9,27.94 90.17,29.21 101.6,29.21 105.41,33.02 105.41,54.61 BLUELED.K
  Bottom 0.406: 77.47,17.78 STRANS.1
  Bottom 0.508: STRANS.1 78.74,17.78 85.09,11.43 LEDTERMINAL1.2

### Text on the board
tPlace: A | 47uf | Main | COM | NO | NC | main heat | smoke | alarm | 12VDC | Smoke | 0.5 A @ 125vac | 1A @ 24vdc | SCL | 4.7k | Relay g5v-1 | M | Smokey Powell | SPDT-2-G5V | SDA | S | 4.7k | 220 | pc817 | 0.1uf | 0.1uf | S | S | V1.3 | A | A | in5819 | 5V | IN5819 | IN5819 | GND | I2C screen 4x20 | 220 | B1 | M | M | S | 47uf | connection | M | M | M | pc817 | P30N06LE | P30N06LE | M=Main | S=Smoke | A=Alarm | 470 | S | B2 | S | M | 470 | 100 | S | 100 | A | M | B3 | 680 | S | 680 | 470 | 10k | 10k | 10k | 10k | M | 10k | 10k | S | 2n2222a | 2n2222a | L7805CV / 5vdc regulator | 2n2222a | B4 | The | M | S | A | A | 680 | 0.1uf | 0.1uf | 0.1uf | A | 0.1uf | 3.3v | B4 | B3 | B2 | B1 | 5v | 0VDC | Main | Smoke | MEAT1 | MEAT2 | 5vdc | MEAT3 | Button Terminal | Transistor Output | Alarm | 12mm buzzer | Pitt | 200 mA Max Sinking to 0Vdc